# Altium project QSTL_Nano_D_Con_Micro_DSUB.PrjPcb
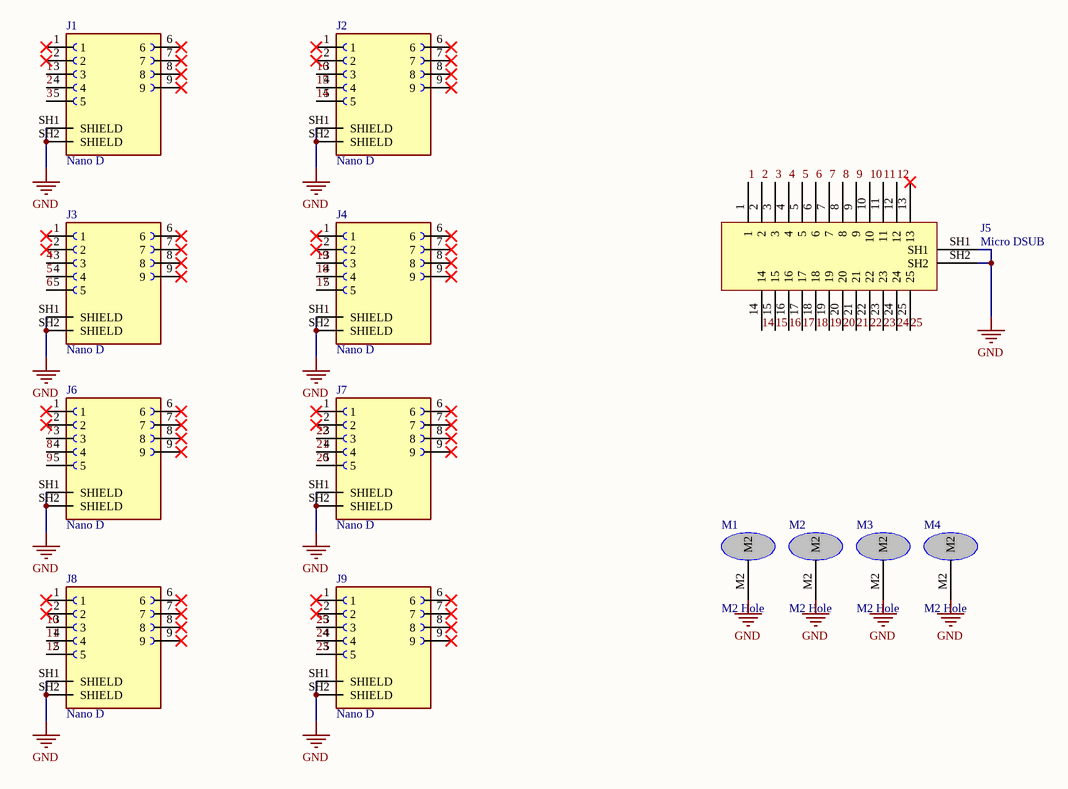
[diagram p0: QSTL_Nano_D_Con_Micro_DSUB.SchDoc]
1 sheet, 13 parts. Net scope: global (net labels, ports and power ports of the same name join across sheets).
Board file: QSTL_Nano_D_Con_Micro_DSUB.PcbDoc

## Sheet QSTL_Nano_D_Con_Micro_DSUB.SchDoc
size A4; SheetNumber: 1; SheetTotal: 1

### Parts
J1  Nano D  [A29500-009]
J2  Nano D  [A29500-009]
J3  Nano D  [A29500-009]
J4  Nano D  [A29500-009]
J5  Micro DSUB  [380-025-113L001]
J6  Nano D  [A29500-009]
J7  Nano D  [A29500-009]
J8  Nano D  [A29500-009]
J9  Nano D  [A29500-009]
M1  M2 Hole  [M2_Hole]
M2  M2 Hole  [M2_Hole]
M3  M2 Hole  [M2_Hole]
M4  M2 Hole  [M2_Hole]

### Nets
GND: J1.SH1(SHIELD) J1.SH2(SHIELD) J2.SH1(SHIELD) J2.SH2(SHIELD) J3.SH1(SHIELD) J3.SH2(SHIELD) J4.SH1(SHIELD) J4.SH2(SHIELD) J5.SH1 J5.SH2 J6.SH1(SHIELD) J6.SH2(SHIELD) J7.SH1(SHIELD) J7.SH2(SHIELD) J8.SH1(SHIELD) J8.SH2(SHIELD) J9.SH1(SHIELD) J9.SH2(SHIELD) M1.M2 M2.M2 M3.M2 M4.M2
1: J1.3 J5.1
2: J1.4 J5.2
3: J1.5 J5.3
4: J3.3 J5.4
5: J3.4 J5.5
6: J3.5 J5.6
7: J5.7 J6.3
8: J5.8 J6.4
9: J5.9 J6.5
10: J5.10 J8.3
11: J5.11 J8.4
12: J5.12 J8.5
14: J2.5 J5.14
15: J2.4 J5.15
16: J2.3 J5.16
17: J4.5 J5.17
18: J4.4 J5.18
19: J4.3 J5.19
20: J5.20 J7.5
21: J5.21 J7.4
22: J5.22 J7.3
23: J5.23 J9.5
24: J5.24 J9.4
25: J5.25 J9.3

Not connected (* = marked no-connect by the designer): J1 1* 2* 6* 7* 8* 9*; J2 1* 2* 6* 7* 8* 9*; J3 1* 2* 6* 7* 8* 9*; J4 1* 2* 6* 7* 8* 9*; J5 13*; J6 1* 2* 6* 7* 8* 9*; J7 1* 2* 6* 7* 8* 9*; J8 1* 2* 6* 7* 8* 9*; J9 1* 2* 6* 7* 8* 9*

### Library data of the parts
J1-J4 J6-J9 = A29500-009: https://www.digikey.ca/en/products/detail/omnetics/A29500-009/16614880
J5 = 380-025-113L001: NorComp Plug Micro DSUB
M1-M4 = M2_Hole